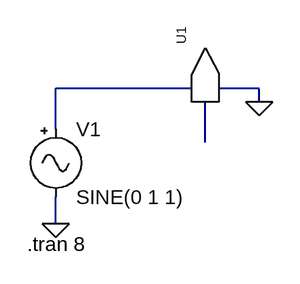
[diagram p0: schematic Subcircuit_Implement.asc]
Subcircuit_Implement.asc, the LTspice schematic file:
Version 4
SHEET 1 880 680
WIRE 176 80 16 80
WIRE 256 80 208 80
WIRE 256 96 256 80
WIRE 16 128 16 80
WIRE 192 144 192 96
WIRE 16 240 16 208
FLAG 16 240 0
FLAG 256 96 0
SYMBOL my_diode_clamp 192 64 R270
SYMATTR InstName U1
SYMBOL Misc\\signal 16 112 R0
WINDOW 123 0 0 Left 0
WINDOW 39 0 0 Left 0
SYMATTR InstName V1
SYMATTR Value SINE(0 1 1)
TEXT -18 264 Left 2 !.tran 8

The netlist it stands for:
* Subcircuit_Implement.asc
XU1 N001 N002 0 my_diode_clamp  ; pins IN OUT GND
V1 N001 0 SINE(0 1 1)
.tran 8
.lib my_diode_clamp.sub
.backanno
.end